# EasyEDA schematic SCH_power_long_clock_2022-06-03.json
TITLE: Sheet_1; REV: 1.0; Date: 2022-04-04; Sheet: 1/1; Drawn By: hhzrbq; Company: Your Company
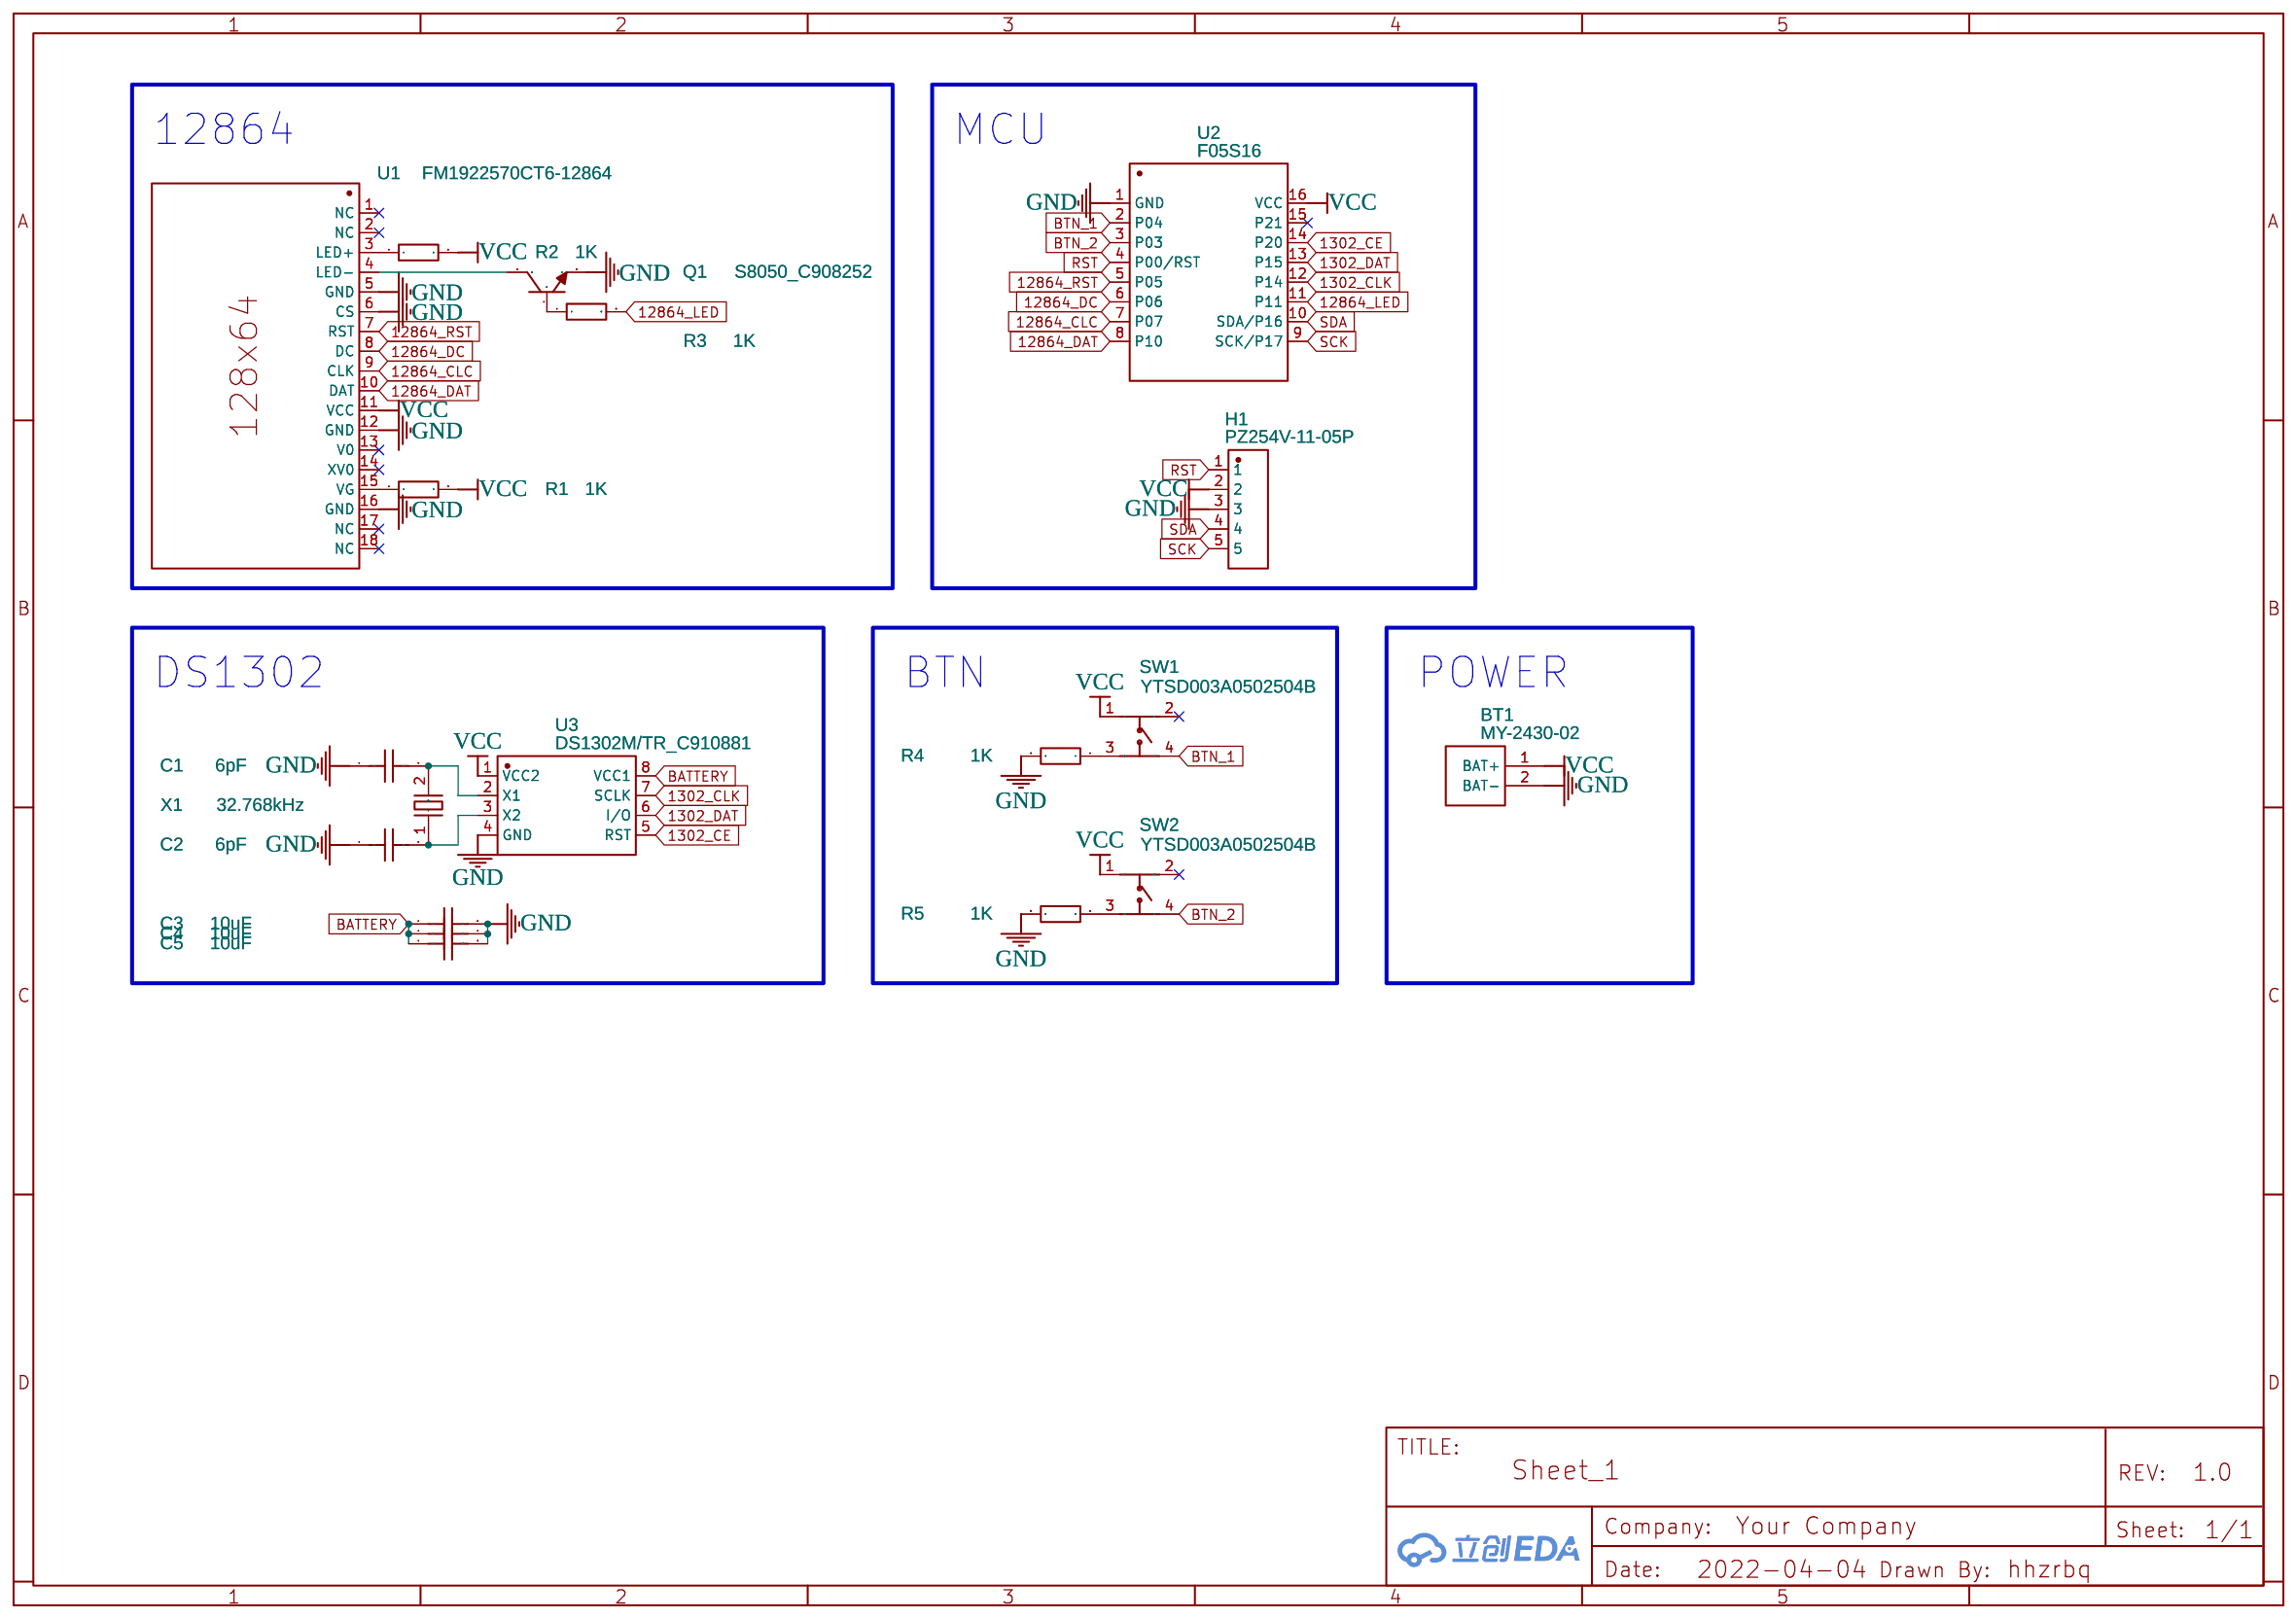
[diagram p0: schematic sheet]

## Parts
BT1  MY-2430-02  [BAT-SMD_MY-2430-02]
C1  6pF  [C0805]
C2  6pF  [C0805]
C3  10uF  [C0805]
C4  10uF  [C0805]
C5  10uF  [C0805]
H1  PZ254V-11-05P  [HDR-TH_5P-P2.54-V-M]
Q1  S8050_C908252  [SOT-23-3_L2.9-W1.3-P1.90-LS2.4-BR]
R1  1K  [R0805]
R2  1K  [R0805]
R3  1K  [R0805]
R4  1K  [R0805]
R5  1K  [R0805]
SW1  YTSD003A0502504B  [KEY-SMD_4P-L6.0-W6.0-P4.50-LS8.6]
SW2  YTSD003A0502504B  [KEY-SMD_4P-L6.0-W6.0-P4.50-LS8.6]
U1  FM1922570CT6-12864  [FPC-SMD_18P-P1.00_12864]
U2  F05S16  [SOP16]
U3  DS1302M/TR_C910881  [SOP-8_L4.9-W3.9-P1.27-LS6.0-BL]
X1  32.768kHz  [CRYSTAL-SMD_L3.2-W1.5]

## Library data of the parts
BT1 = MY-2430-02: Supplier: LCSC; Supplier Part: C964843; Manufacturer: MYOUNG; Contributor: LCSC; JLCPCB Part Class: Extended Part
C1 C2 = 0805N6R0D500CT: Supplier: LCSC; Supplier Part: C424859; Manufacturer: Walsin Tech Corp; Contributor: LCSC
C3-C5 = C_0805_US: Contributor: LCEDA_Lib
H1 = PZ254V-11-05P: Supplier: LCSC; Supplier Part: C492404; Manufacturer: XFCN; Contributor: LCSC; JLCPCB Part Class: Extended Part
Q1 = S8050_C908252: Supplier: LCSC; Supplier Part: C908252; Manufacturer: FUXINSEMI; Manufacturer Part: S8050; Contributor: LCSC; Paste Type: expand
R1-R5 = RK73B2ATTD102J: Supplier: LCSC; Manufacturer: KOA; Contributor: LCSC; Supplier Part: C159911; JLCPCB Part Class: Extended Part
SW1 SW2 = YTSD003A0502504B: Supplier: LCSC; Supplier Part: C2689406; Manufacturer: DGBZ(东莞博众); Contributor: LCSC
U1 = FM1922570CT6-12864: Supplier: laowang; Contributor: hhzrbq
U2 = F05S16: Supplier: Sinomicon; Contributor: hhzrbq
U3 = DS1302M/TR_C910881: Supplier: LCSC; Supplier Part: C910881; Manufacturer: HGC(华冠); Manufacturer Part: DS1302M/TR; Contributor: LCSC; JLCPCB Part Class: Extended Part
X1 = Q13FC13500005: Supplier: LCSC; Supplier Part: C841881; Manufacturer: EPSON(爱普生); JLCPCB Part Class: Extended Part; Contributor: LCSC

## Nets
GND: BT1.2(BAT-) C1.1 C2.1 C3.2 C4.2 C5.2 H1.3 Q1.2(E) R4.2 R5.2 U1.5(GND) U1.6(CS) U1.12(GND) U1.16(GND) U2.1(GND) U3.4(GND)
VCC: BT1.1(BAT+) H1.2 R1.2 R2.2 SW1.1 SW2.1 U1.11(VCC) U2.16(VCC) U3.1(VCC2)
1302_CE: U2.14(P20) U3.5(RST)
1302_CLK: U2.12(P14) U3.7(SCLK)
1302_DAT: U2.13(P15) U3.6(I/O)
12864_CLC: U1.9(CLK) U2.7(P07)
12864_DAT: U1.10(DAT) U2.8(P10)
12864_DC: U1.8(DC) U2.6(P06)
12864_LED: R3.2 U2.11(P11)
12864_RST: U1.7(RST) U2.5(P05)
BATTERY: C3.1 C4.1 C5.1 U3.8(VCC1)
BTN_1: SW1.4 U2.2(P04)
BTN_2: SW2.4 U2.3(P03)
RST: H1.1 U2.4(P00/RST)
SCK: H1.5 U2.9(SCK/P17)
SDA: H1.4 U2.10(SDA/P16)
Net-(C1-2): C1.2 U3.2(X1) X1.2(GND)
Net-(C2-2): C2.2 U3.3(X2) X1.1
Net-(Q1-1): Q1.1(B) R3.1
Net-(Q1-3): Q1.3(C) U1.4(LED-)
Net-(R1-1): R1.1 U1.15(VG)
Net-(R2-1): R2.1 U1.3(LED+)
Net-(R4-1): R4.1 SW1.3
Net-(R5-1): R5.1 SW2.3

Not connected (* = marked no-connect by the designer): SW1 2*; SW2 2*; U1 1(NC)* 2(NC)* 13(V0)* 14(XV0)* 17(NC)* 18(NC)*; U2 15(P21)*

## Notes on the sheet
- 12864
- MCU
- DS1302
- BTN
- POWER
